# EAGLE design untitled (EAGLE 7.5.0)
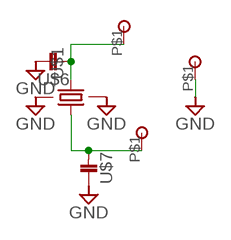
[diagram p0: schematic, sheet 1]

## Parts
U$1  FA-238  [FA-238]
U$4  CHECK_0.8MM  [CHECK_0.8MM]
U$5  CHECK_0.8MM  [CHECK_0.8MM]
U$6  1608  [1608]
U$7  1608  [1608]
U$10  CHECK_0.8MM  [CHECK_0.8MM]

## Nets
GND: U$1.2 U$1.4 U$6.P$1 U$7.P$1 U$10.P$1
N$1: U$1.1 U$5.P$1 U$7.P$2
N$2: U$1.3 U$4.P$1 U$6.P$2

## Library data of the parts
U$1 = 09_2_CRYSTAL:FA-238
U$4 U$5 U$10 = 08_CONECTOR:CHECK_0.8MM
U$6 U$7 = 02_C:1608

## Board
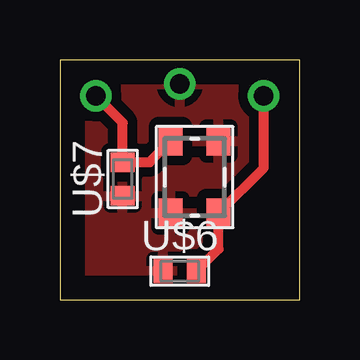
[diagram p1: board, top side]

Size 10 x 10 mm. Coordinates in mm from the lower left corner, seen from the top.
Outline: 0,0 10,0 10,10 0,10 0,0
Copper layers (1*16): Top 0.035mm / dielectric 1.5mm / Bottom 0.035mm
Design rules "default *": minimum track width 10mil, minimum drill 24mil, track to track 16mil, track to pad 16mil, pad to pad 16mil, via to via 8mil, smd to smd 8mil, copper to edge 40mil, drill to drill 8mil, minimum pad ring 10mil, minimum via ring 8mil, stop-mask expansion 4mil, vias tented up to drill 0mil, thermal gap 12mil

### Footprints (pad centres in the part's own frame; a part is rotated, then mirrored left to right if it is on the bottom)
FA-238 = smd 1.2 x 1: 1 -1.5,-1; 2 1.5,-1; 3 1.5,1; 4 -1.5,1
CHECK_0.8MM = drill 0.8: P$1 0,0
1608 = smd 0.8 x 1: P$1 -0.7,0; P$2 0.7,0

### Placement (x,y rotation side)
U$1  5.62,5.11 270 top
U$4  8.5,8.5 0 top
U$5  1.5,8.5 0 top
U$6  5,1.19 0 top
U$7  2.62,5.03 90 top
U$10  5,9 0 top

### Tracks (layer width: path | path; a pad name or v marks a point on that pad's centre or on a via)
GND
  pour Top: 0,10 10,10 10,0 0,0
N$1
  Top 0.406: U$5.P$1 2.62,7.38 U$7.P$2 3.74,5.73 U$1.1
N$2
  Top 0.406: U$6.P$2 6.62,2.11 U$1.3 8.5,5.49 U$4.P$1